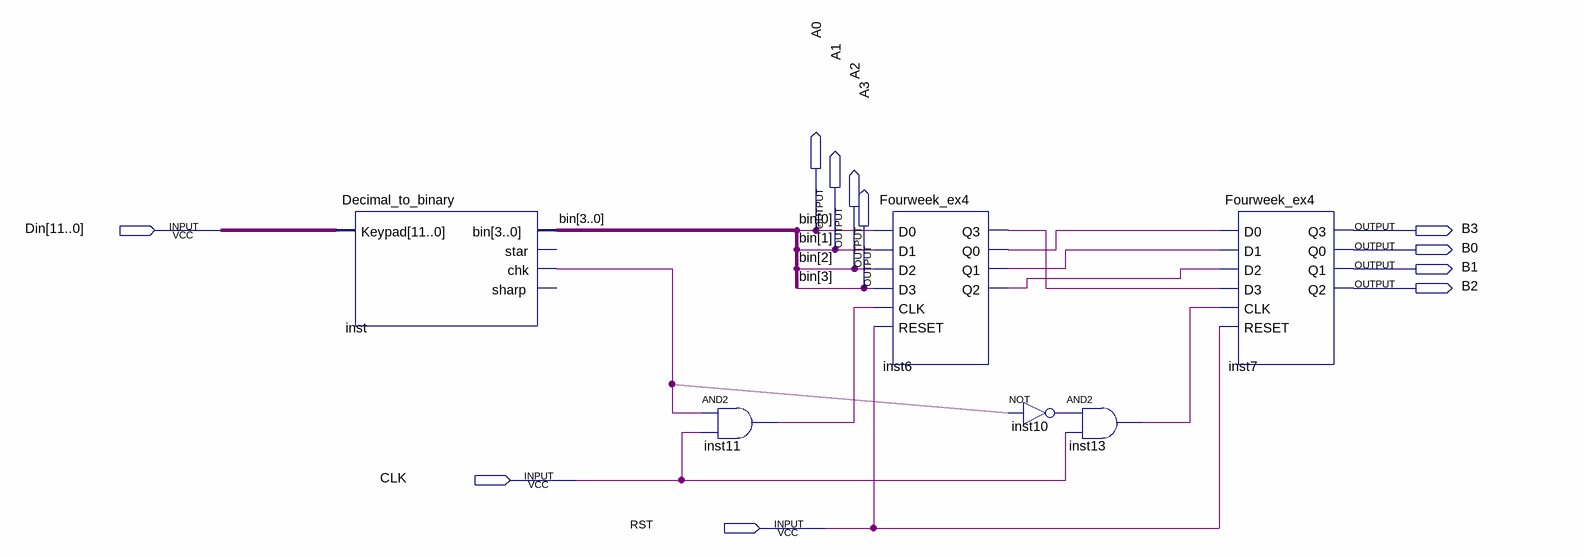
[diagram p0: schematic sheet]
// Quartus schematic Fourweek_ex5.bdf as structural Verilog: 6 symbols, 11 pins
module Fourweek_ex5 (
  input  [11:0] Din,
  input  CLK,
  input  RST,
  output A0,
  output B3,
  output A1,
  output B0,
  output A2,
  output B1,
  output A3,
  output B2
);

  wire inst6_q0, inst6_q1, inst6_q2, inst6_q3, inst10_out, inst11_out, inst13_out, inst_chk;

  Decimal_to_binary inst (.Keypad(Din), .bin({A3, A2, A1, A0}), .chk(inst_chk));  // open: star, sharp
  and inst11 (inst11_out, inst_chk, CLK);
  Fourweek_ex4 inst6 (
    .D0(A0), .D1(A1), .D2(A2), .D3(A3), .CLK(inst11_out), .RESET(RST), .Q3(inst6_q3), .Q0(inst6_q0),
    .Q1(inst6_q1), .Q2(inst6_q2));
  not inst10 (inst10_out, inst_chk);
  and inst13 (inst13_out, inst10_out, CLK);
  Fourweek_ex4 inst7 (
    .D0(inst6_q0), .D1(inst6_q1), .D2(inst6_q2), .D3(inst6_q3), .CLK(inst13_out), .RESET(RST), .Q3(B3),
    .Q0(B0), .Q1(B1), .Q2(B2));

  // Other names for the same wires on the sheet: bin[3:0] = {A3, A2, A1, A0}
endmodule
